# Altium project LiPoMon_PCB.PrjPcb
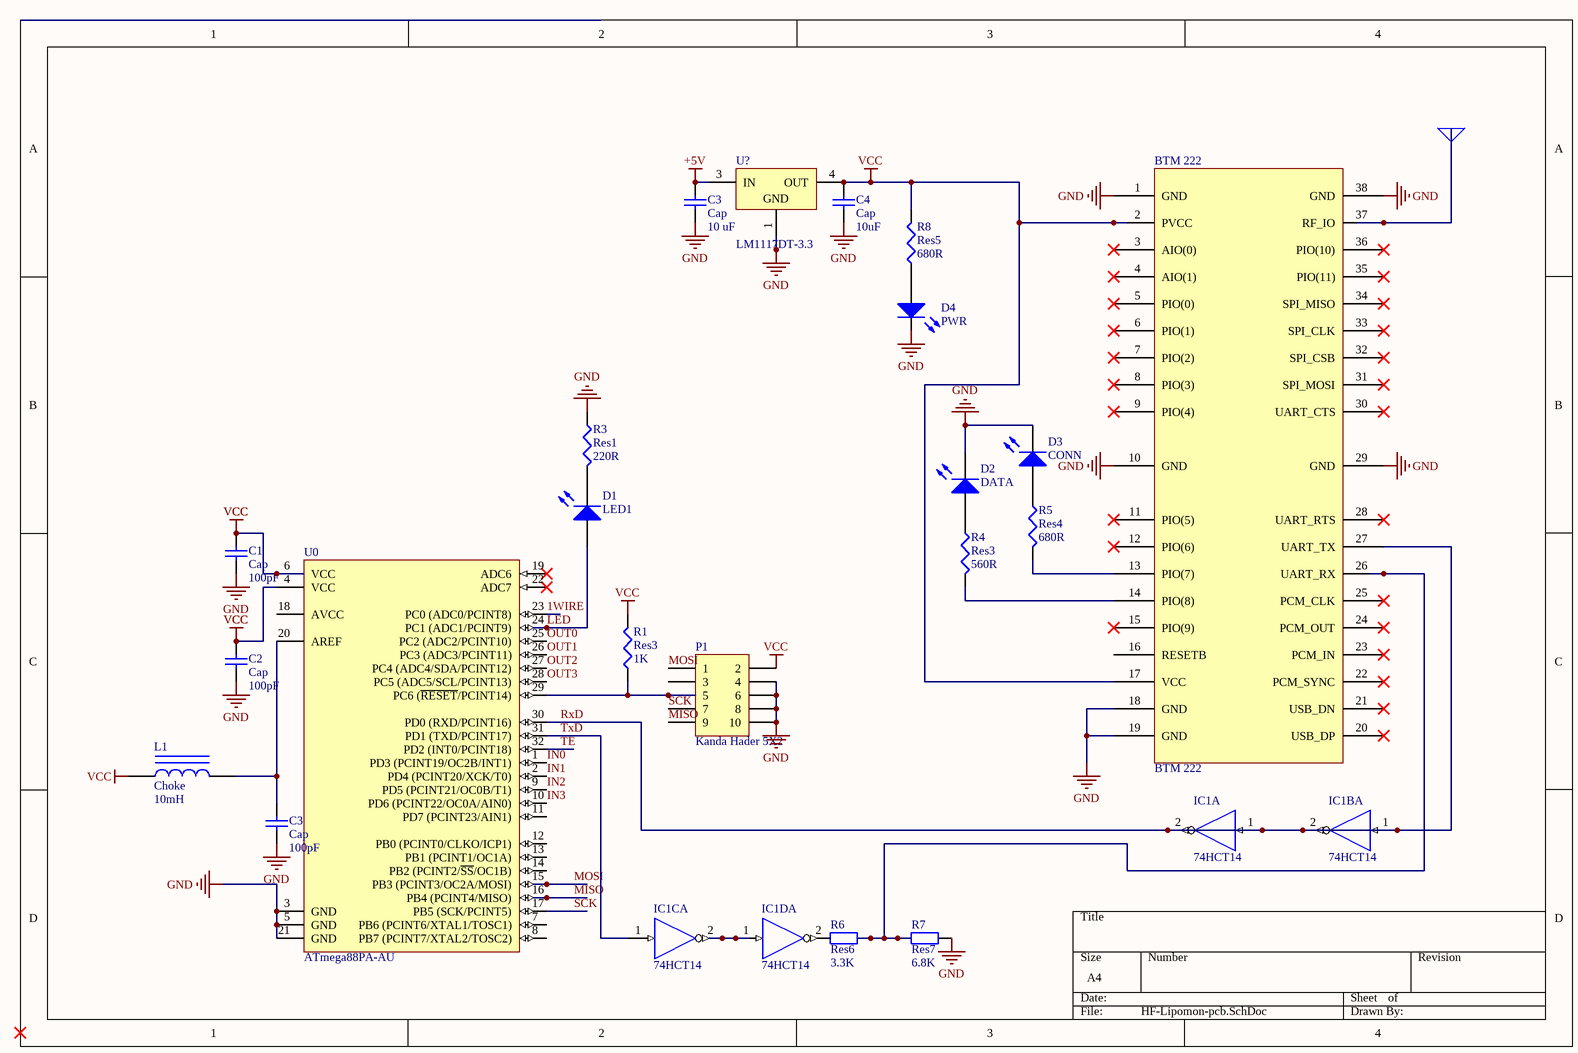
[diagram p0: HF-Lipomon-pcb.SchDoc]
1 sheet, 25 parts. Net scope: global (net labels, ports and power ports of the same name join across sheets).
Board file: PCB1.PcbDoc

## Sheet HF-Lipomon-pcb.SchDoc
size A4

### Parts
(Parts that share a designator on the sheet are numbered #1, #2 ... from top to bottom, then left to right.)
BTM_222  BTM 222  [BTM222]
C1  Cap  value 100pF  [C0805]
C2  Cap  value 100pF  [C0805]
C3#1  Cap  value 10 uF  [0402]
C3#2  Cap  value 100pF  [C0805]
C4  Cap  value 10uF  [0402]
D1  LED1  [C1206]
D2  DATA  [C1206]
D3  CONN  [C1206]
D4  PWR  [C1206]
IC1  74HCT14  [D014_N]  (part A of 6)
IC1B  74HCT14  [D014_N]  (part A of 6)
IC1C  74HCT14  [D014_N]  (part A of 6)
IC1D  74HCT14  [D014_N]  (part A of 6)
L1  Choke  value 10mH  [6-0805_N]
P1  Kanda Hader 5X2  [HDR2X5]
R1  Res3  value 1K  [6-0805_N]
R3  Res1  value 220R  [6-0805_N]
R4  Res3  value 560R  [6-0805_N]
R5  Res4  value 680R  [6-0805_N]
R6  Res6  value 3.3K  [6-0805_L]
R7  Res7  value 6.8K  [6-0805_L]
R8  Res5  value 680R  [6-0805_N]
U0  ATmega88PA-AU  [32A_N]
U?  LM1117DT-3.3  [TD03B_N]

### Nets
+5V: C3#1.2 U?.3(IN)
GND: BTM_222.1(GND) BTM_222.10(GND) BTM_222.18(GND) BTM_222.19(GND) BTM_222.29(GND) BTM_222.38(GND) C1.1 C2.1 C3#1.1 C3#2.1 C4.1 D2.2(K) D3.2(K) IC1.7(GND) IC1B.7(GND) IC1C.7(GND) IC1D.7(GND) P1.4 P1.6 P1.8 P1.10 R3.1 R7.2 U0.3(GND) U0.5(GND) U0.21(GND) U?.1(GND)
VCC: BTM_222.2(PVCC) BTM_222.17(VCC) C1.2 C2.2 C4.2 IC1.14(VCC) IC1B.14(VCC) IC1C.14(VCC) IC1D.14(VCC) L1.1 P1.2 R1.2 R8.2 U0.4(VCC) U0.6(VCC) U?.4(OUT)
1WIRE: U0.23(PC0_(ADC0/PCINT8))
IN0: U0.1(PD3_(PCINT19/OC2B/INT1))
IN1: U0.2(PD4_(PCINT20/XCK/T0))
IN2: U0.9(PD5_(PCINT21/OC0B/T1))
IN3: U0.10(PD6_(PCINT22/OC0A/AIN0))
LED: D1.1(A) U0.24(PC1_(ADC1/PCINT9))
MISO: P1.9 U0.16(PB4_(PCINT4/MISO))
MOSI: P1.1 U0.15(PB3_(PCINT3/OC2A/MOSI))
OUT0: U0.25(PC2_(ADC2/PCINT10))
OUT1: U0.26(PC3_(ADC3/PCINT11))
OUT2: U0.27(PC4_(ADC4/SDA/PCINT12))
OUT3: U0.28(PC5_(ADC5/SCL/PCINT13))
RxD: BTM_222.27(UART_TX) IC1.1(A) IC1.2(Y) IC1B.1(A) IC1B.2(Y) U0.30(PD0_(RXD/PCINT16))
SCK: P1.7 U0.17(PB5_(SCK/PCINT5))
TE: U0.32(PD2_(INT0/PCINT18))
TxD: IC1C.1(A) U0.31(PD1_(TXD/PCINT17))
NetBTM_222_13: BTM_222.13(PIO(7)) R5.2
NetBTM_222_14: BTM_222.14(PIO(8)) R4.2
NetBTM_222_26: BTM_222.26(UART_RX) R6.2 R7.1
NetC3#2_2: C3#2.2 L1.2 U0.20(AREF)
NetD1_2: D1.2(K) R3.2
NetD2_1: D2.1(A) R4.1
NetD3_1: D3.1(A) R5.1
NetD4_1: D4.1(A) R8.1
NetIC1C_2: IC1C.2(Y) IC1D.1(A)
NetP1_5: P1.5 R1.1 U0.29(PC6_(~{RESET}/PCINT14))

Not connected (* = marked no-connect by the designer): BTM_222 3(AIO(0))* 4(AIO(1))* 5(PIO(0))* 6(PIO(1))* 7(PIO(2))* 8(PIO(3))* 9(PIO(4))* 11(PIO(5))* 12(PIO(6))* 15(PIO(9))* 16(RESETB) 20(USB_DP)* 21(USB_DN)* 22(PCM_SYNC)* 23(PCM_IN)* 24(PCM_OUT)* 25(PCM_CLK)* 28(UART_RTS)* 30(UART_CTS)* 31(SPI_MOSI)* 32(SPI_CSB)* 33(SPI_CLK)* 34(SPI_MISO)* 35(PIO(11))* 36(PIO(10))* 37(RF_IO); D4 2(K); IC1D 2(Y); P1 3; R6 1; U0 7(PB6_(PCINT6/XTAL1/TOSC1)) 8(PB7_(PCINT7/XTAL2/TOSC2)) 11(PD7_(PCINT23/AIN1)) 12(PB0_(PCINT0/CLKO/ICP1)) 13(PB1_(PCINT1/OC1A)) 14(PB2_(PCINT2/~{SS}/OC1B)) 18(AVCC) 19(ADC6)* 22(ADC7)*

### Notes on the sheet
- Labels drawn without touching a wire or pin: GND

### Library data of the parts
C1 C2 C3#1 C3#2 C4 = Cap: Capacitor; Published: 8-Jun-2000; LatestRevisionDate: 17-Jul-2002; LatestRevisionNote: Re-released for DXP Platform.; PackageReference: RAD-0.3; Publisher: Altium Limited; PackageDescription: Radial Cap, Thru-Hole; 2 Leads; 0.3 in Pin Spacing
D1-D4 = LED3: Typical BLUE SiC LED; Published: 8-Jun-2000; LatestRevisionDate: 17-Dec-2003; LatestRevisionNote: PCB Footprint replaced.; DatasheetVersion: 16-Apr-2002; PackageVersion: 16-Apr-2002; PackageReference: 3.5X2.8X1.9; Publisher: Altium Limited; PackageDescription: SM LED; 2 C-Bend Leads; Body 3.5 x 2.8 x 1.9 mm, inc leads (LxWxH typ)
IC1 IC1B IC1C IC1D = SN74F04D: Hex Inverter; Published: 8-Jun-2000; LatestRevisionDate: 13-Apr-2006; LatestRevisionNote: IPC-7351 Footprint Added.; DatasheetVersion: Oct-1993; PackageVersion: Jan-1998; PackageReference: D014; Publisher: Altium Limited; PackageDescription: 14-Pin Small Outline Integrated Circuit 1.27 mm Pitch; Code_IPC: SOIC127P600-14; ComponentLink1Description: Manufacturer Link; ComponentLink1URL: http://www.ti.com/; ComponentLink2Description: Datasheet; ComponentLink2URL: http://www-s.ti.com/sc/ds/SN54F04.pdf
L1 = Inductor Iron: Magnetic-Core Inductor; Published: 24-Mar-1999; LatestRevisionDate: 17-Jul-2002; LatestRevisionNote: Re-released for DXP Platform.; PackageReference: AXIAL-0.9; Publisher: Altium Limited; PackageDescription: Axial Device, Thru-Hole; 2 Leads; 0.9 in Pin Spacing
P1 = Header 5X2: Header, 5-Pin, Dual row; LatestRevisionDate: 17-Jul-2002; LatestRevisionNote: Re-released for DXP Platform.; Publisher: Altium Limited
R1 R3-R5 R8 = Res3: Resistor; Published: 8-Jun-2000; LatestRevisionDate: 29-May-2009; LatestRevisionNote: IPC-7351 Footprint Added.; PackageReference: J1-0603; Publisher: Altium Limited; PackageDescription: Chip Resistor
R6 R7 = Res2: Resistor; Published: 8-Jun-2000; LatestRevisionDate: 17-Jul-2002; LatestRevisionNote: Re-released for DXP Platform.; PackageReference: AXIAL-0.4; Publisher: Altium Limited; PackageDescription: Axial Device, Thru-Hole; 2 Leads; 0.4 in Pin Spacing
U0 = ATmega88PA-AU: 8-bit AVR Microcontroller, 8KB Flash, 512 Bytes EEPROM, 1KB SRAM, 32-pin TQFP, Industrial Grade (-40°C to 85°C); Published: 1-Apr-2010; DatasheetVersion: revA, Jan-2010; PackageVersion: revB, Oct-2001; PackageReference: 32A; Publisher: Altium Limited; PackageDescription: 32-Lead, 7x7x1.0 mm Body, 0.8mm Lead Pitch, Thin Profile Plastic Quad Flat Package (TQFP); Supplier 1: Digi-Key; Supplier Part Number 1: ATMEGA88PA-AU-ND; Supplier 2: Farnell; Supplier Part Number 2: 1715490; Supplier 3: Mouser; Supplier Part Number 3: 556-ATMEGA88PA-AU; Code_JEDEC: MS-026-ABA; ComponentLink1Description: Manufacturer Link; ComponentLink1URL: http://www.atmel.com/products/avr/default.asp?; ComponentLink2Description: ATmega48A/48PA/88A/88PA/168A/168PA/328/328P Datasheet; ComponentLink2URL: http://www.atmel.com/dyn/resources/prod_documents/8271.pdf; ComponentLink3Description: ATmega48A/48PA/88A/88PA/168A/168PA/328/328P Summary; ComponentLink3URL: http://www.atmel.com/dyn/resources/prod_documents/8271S.pdf; ComponentLink4Description: Atmel.com Home; ComponentLink4URL: http://www.atmel.com
U? = LM1117DT-3.3: 800mA Low-Dropout Linear Regulator, 3-pin TO-252; Manufacturer: National Semiconductor; PackageTopMarking: NSUZXYTT*LM1117*DT-3.3; PowerWise: N; CompType: LDO IC; High-Reliability: Y; DatasheetVersion: Apr-2006; PackageVersion: revD, Feb-2009; PackageReference: TD03B; PackageDescription: TO252, Molded, Jedec, 6.8 x 6.10 x 2.30mm Body, 3 Lead, 2.28mm Pitch, Surface Mount; PartNumber: LM1117DT-3.3; RoHS: N; PinCount: 3; Code_JEDEC: TO-252-AA; ComponentLink1Description: Manufacturer URL; ComponentLink1URL: http://www.national.com/; ComponentLink2Description: LM1117 Datasheet; ComponentLink2URL: http://www.national.com/ds/LM/LM1117.pdf; ComponentLink3Description: LM1117 Web Page; ComponentLink3URL: http://www.national.com/pf/LM/LM1117.html; ComponentLink4Description: TD03B Package Page; ComponentLink4URL: http://www.national.com/packaging/folders/td03b.html